# Altium project PowerSystem.PrjPCB
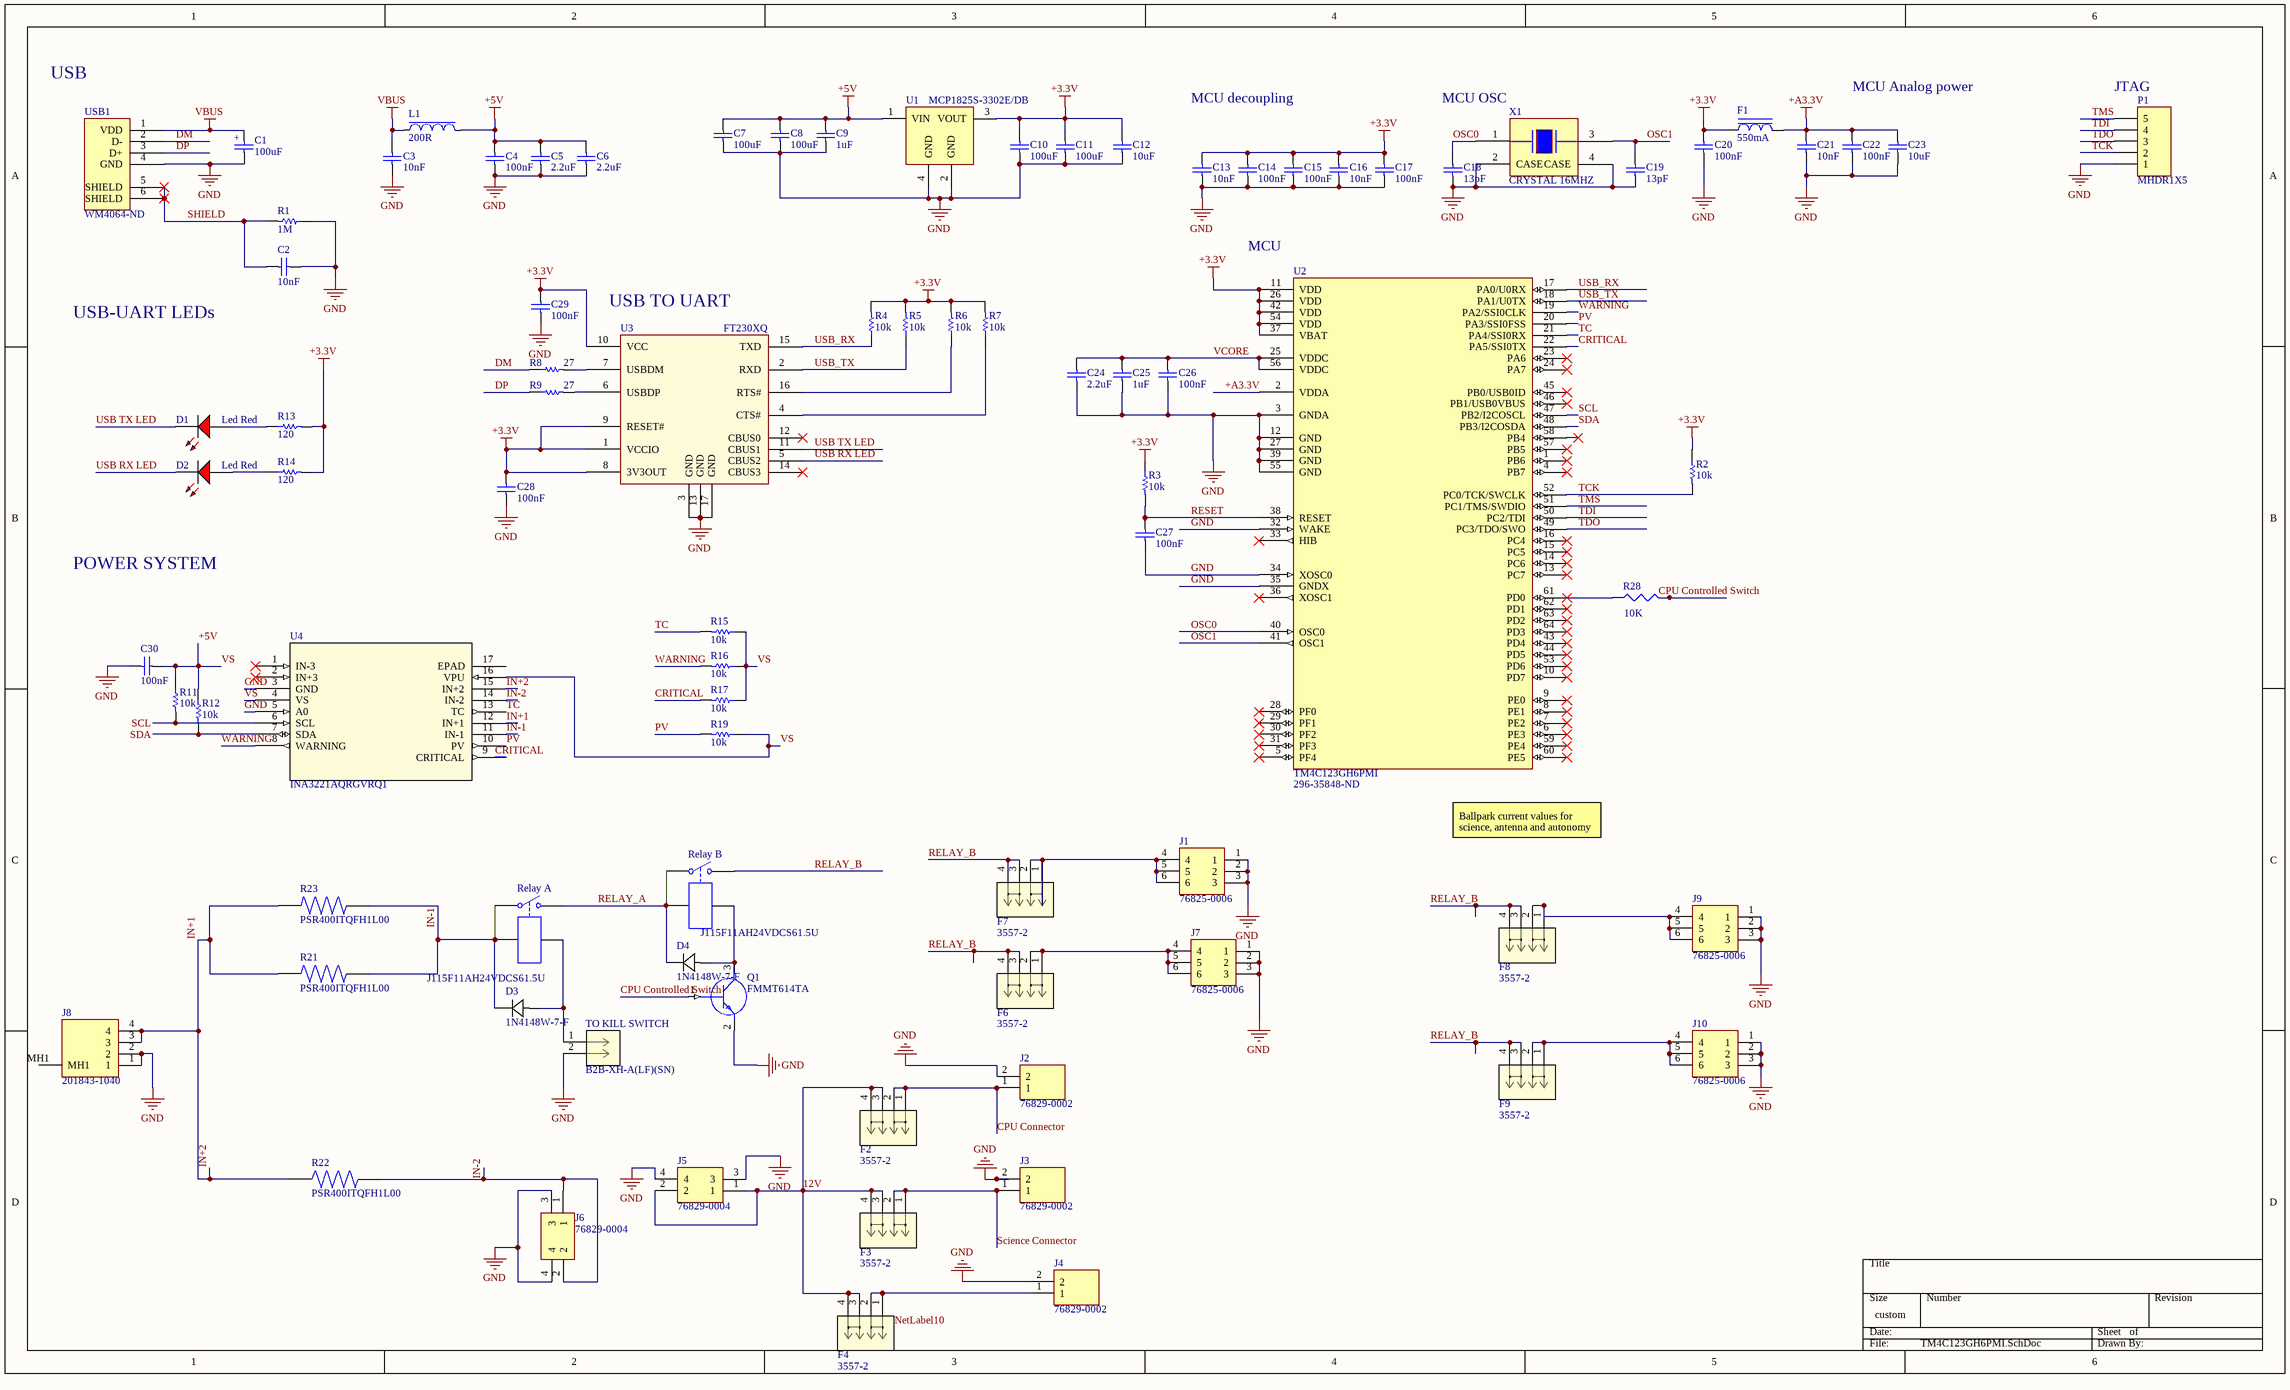
[diagram p0: TM4C123GH6PMI.SchDoc]
1 sheet, 85 parts. Net scope: global (net labels, ports and power ports of the same name join across sheets).
Board file: PCB_power.PcbDoc

## Sheet TM4C123GH6PMI.SchDoc
size 508 x 304 mm

### Parts
C1  100uF  [CapAlu6.3mmx12.5mm]
C2  10nF  [CAP_1206]
C3  10nF  [CAP_0402_M]
C4  100nF  [CAP_0402_M]
C5  2.2uF  [CAP_0402_M]
C6  2.2uF  [CAP_0402_M]
C7  100uF  [CAP_1206]
C8  100uF  [CAP_1206]
C9  1uF  [CAP_0402_M]
C10  100uF  [CAP_1206]
C11  100uF  [CAP_1206]
C12  10uF  [CAP_0603]
C13  10nF  [CAP_0402_M]
C14  100nF  [CAP_0402_M]
C15  100nF  [CAP_0402_M]
C16  10nF  [CAP_0402_M]
C17  100nF  [CAP_0402_M]
C18  13pF  [CAP_0402_M]
C19  13pF  [CAP_0402_M]
C20  100nF  [CAP_0402_M]
C21  10nF  [CAP_0402_M]
C22  100nF  [CAP_0402_M]
C23  10uF  [CAP_0603]
C24  2.2uF  [CAP_0603]
C25  1uF  [CAP_0402_M]
C26  100nF  [CAP_0402_M]
C27  100nF  [CAP_0402_M]
C28  100nF  [CAP_0402_M]
C29  100nF  [CAP_0402_M]
C30  100nF  [CAP_0603]
D1  Led Red  [TOPLED 0805]
D2  Led Red  [TOPLED 0805]
D3  1N4148W-7-F  [SOD123_DIO]
D4  1N4148W-7-F  [SOD123_DIO]
F1  550mA  [RES_0402_M]
F2  3557-2  [CONN_3557-2_KEY]
F3  3557-2  [CONN_3557-2_KEY]
F4  3557-2  [CONN_3557-2_KEY]
F6  3557-2  [CONN_3557-2_KEY]
F7  3557-2  [CONN_3557-2_KEY]
F8  3557-2  [CONN_3557-2_KEY]
F9  3557-2  [CONN_3557-2_KEY]
J1  76825-0006  [0768250006]
J2  76829-0002  [768290002]
J3  76829-0002  [768290002]
J4  76829-0002  [768290002]
J5  76829-0004  [768290004]
J6  76829-0004  [768290004]
J7  76825-0006  [0768250006]
J8  201843-1040  [2018431040]
J9  76825-0006  [0768250006]
J10  76825-0006  [0768250006]
L1  200R  [IND_0603]
P1  MHDR1X5  [MHDR1X5]
Q1  FMMT614TA  [SOT95P230X110-3N]
R1  1M  [RES_1206]
R2  10k  [RES_0402_M]
R3  10k  [RES_0402_M]
R4  10k  [RES_0402_M]
R5  10k  [RES_0402_M]
R6  10k  [RES_0402_M]
R7  10k  [RES_0402_M]
R8  27  [RES_0402_M]
R9  27  [RES_0402_M]
R11  10k  [RES_0603]
R12  10k  [RES_0603]
R13  120  [RES_0402_M]
R14  120  [RES_0402_M]
R15  10k  [RES_0603]
R16  10k  [RES_0603]
R17  10k  [RES_0603]
R19  10k  [RES_0603]
R21  PSR400ITQFH1L00  [RESC10052X105N]
R22  PSR400ITQFH1L00  [RESC10052X105N]
R23  PSR400ITQFH1L00  [RESC10052X105N]
R28  value 10K  [J1-0603]
Relay_A  J115F11AH24VDCS61.5U  [MODULE4]
Relay_B  J115F11AH24VDCS61.5U  [MODULE4]
TO_KILL_SWITCH  B2B-XH-A(LF)(SN)  [CONN_B2B-XH-A(LF)(SN)_JST]
U1  MCP1825S-3302E/DB  [SOT230P700X180-4N]
U2  TM4C123GH6PMI  Supplier Part Number 1: 296-35848-ND  [TSQFP50P1200X1200X120-64N]
U3  FT230XQ  [QFN65P400X400X80_HS-17N]
U4  INA3221AQRGVRQ1  [RGV16_2P16X2P16_]
USB1  Supplier Part Number 1: WM4064-ND  [USB2.5-2H4E]  (hidden comment: USB type-B jack)
X1  CRYSTAL 16MHZ  [CRYSTAL_3.2x2.5]

### Nets
+3.3V: C10.1 C11.1 C12.1 C13.2 C14.2 C15.2 C16.2 C17.2 C20.2 C28.2 C29.2 F1.1 R2.1 R3.1 R4.2 R5.2 R6.2 R7.2 R13.2 R14.2 U1.3(VOUT) U2.11(VDD) U2.26(VDD) U2.37(VBAT) U2.42(VDD) U2.54(VDD) U3.1(VCCIO) U3.8(3V3OUT) U3.9(RESET#) U3.10(VCC)
+5V: C4.2 C5.2 C6.2 C7.1 C8.1 C9.2 C30.2 L1.2 R11.1 R12.1 R15.1 R16.1 R17.1 R19.1 U1.1(VIN) U4.4(VS) U4.16(VPU)  [also labelled VS]
+A3.3V: C21.2 C22.2 C23.2 F1.2 U2.2(VDDA)
GND: C1.2 C2.1 C3.1 C4.1 C5.1 C6.1 C7.2 C8.2 C9.1 C10.2 C11.2 C12.2 C13.1 C14.1 C15.1 C16.1 C17.1 C18.1 C19.1 C20.1 C21.1 C22.1 C23.1 C24.1 C25.1 C26.1 C27.1 C28.1 C29.1 C30.1 J1.1 J1.2 J1.3 J2.2 J3.2 J4.2 J5.3 J5.4 J6.3 J6.4 J7.1 J7.2 J7.3 J8.1 J8.2 J9.1 J9.2 J9.3 J10.1 J10.2 J10.3 P1.1 Q1.2(E) R1.1 TO_KILL_SWITCH.2 U1.2(GND) U1.4(GND) U2.3(GNDA) U2.12(GND) U2.27(GND) U2.32(WAKE) U2.34(XOSC0) U2.35(GNDX) U2.39(GND) U2.55(GND) U3.3(GND) U3.13(GND) U3.17(GND) U4.3(GND) U4.5(A0) USB1.4(GND) X1.2(CASE) X1.4(CASE)
VBUS: C1.1 C3.2 L1.1 USB1.1(VDD)
12V: F2.3 F2.4 F3.3 F3.4 F4.3 F4.4 J5.1 J5.2
CPU Connector: F2.1 F2.2 J2.1
CPU Controlled Switch: Q1.1(B) R28.2
CRITICAL: R17.2 U2.22(PA5/SSI0TX) U4.9(CRITICAL)
DM: R8.1 USB1.2(D-)
DP: R9.1 USB1.3(D+)
IN+1: J8.3 J8.4 R21.1 R22.1 R23.1 U4.12(IN+1) U4.15(IN+2)  [also labelled IN+2]
IN-1: D3.1 R21.2 R23.2 Relay_A.1 Relay_A.3 U4.11(IN-1)
IN-2: J6.1 J6.2 R22.2 U4.14(IN-2)
OSC0: C18.2 U2.40(OSC0) X1.1
OSC1: C19.2 U2.41(OSC1) X1.3
PV: R19.2 U2.20(PA3/SSI0FSS) U4.10(PV)
RELAY_A: D4.1 Relay_A.2 Relay_B.1 Relay_B.3
RELAY_B: F6.3 F6.4 F7.3 F7.4 F8.3 F8.4 F9.3 F9.4 Relay_B.2
RESET: C27.2 R3.2 U2.38(RESET)
Science Connector: F3.1 F3.2 J3.1
SCL: R11.2 U2.47(PB2/I2COSCL) U4.6(SCL)
SDA: R12.2 U2.48(PB3/I2COSDA) U4.7(SDA)
SHIELD: C2.2 R1.2 USB1.5(SHIELD) USB1.6(SHIELD)
TC: R15.2 U2.21(PA4/SSI0RX) U4.13(TC)
TCK: P1.2 R2.2 U2.52(PC0/TCK/SWCLK)
TDI: P1.4 U2.50(PC2/TDI)
TDO: P1.3 U2.49(PC3/TDO/SWO)
TMS: P1.5 U2.51(PC1/TMS/SWDIO)
USB RX LED: D2.2(K) U3.5(CBUS2)
USB TX LED: D1.2(K) U3.11(CBUS1)
USB_RX: R4.1 U2.17(PA0/U0RX) U3.15(TXD)
USB_TX: R5.1 U2.18(PA1/U0TX) U3.2(RXD)
VCORE: C24.2 C25.2 C26.2 U2.25(VDDC) U2.56(VDDC)
WARNING: R16.2 U2.19(PA2/SSI0CLK) U4.8(WARNING)
NetD1_1: D1.1(A) R13.1
NetD2_1: D2.1(A) R14.1
NetD3_2: D3.2 Relay_A.4 TO_KILL_SWITCH.1
NetD4_2: D4.2 Q1.3(C) Relay_B.4
NetF4_1: F4.1 F4.2 J4.1
NetF6_1: F6.1 F6.2 J7.4 J7.5 J7.6
NetF7_1: F7.1 F7.2 J1.4 J1.5 J1.6
NetF8_1: F8.1 F8.2 J9.4 J9.5 J9.6
NetF9_1: F9.1 F9.2 J10.4 J10.5 J10.6
NetR6_1: R6.1 U3.16(RTS#)
NetR7_1: R7.1 U3.4(CTS#)
NetR8_2: R8.2 U3.7(USBDM)
NetR9_2: R9.2 U3.6(USBDP)
NetR28_1: R28.1 U2.61(PD0)

Not connected (* = marked no-connect by the designer): J8 MH1; U2 1(PB6)* 4(PB7)* 5(PF4)* 6(PE3)* 7(PE2)* 8(PE1)* 9(PE0)* 10(PD7)* 13(PC7)* 14(PC6)* 15(PC5)* 16(PC4)* 23(PA6)* 24(PA7)* 28(PF0)* 29(PF1)* 30(PF2)* 31(PF3)* 33(HIB)* 36(XOSC1)* 43(PD4)* 44(PD5)* 45(PB0/USB0ID)* 46(PB1/USB0VBUS)* 53(PD6)* 57(PB5)* 58(PB4)* 59(PE4)* 60(PE5)* 62(PD1)* 63(PD2)* 64(PD3)*; U3 12(CBUS0)* 14(CBUS3)*; U4 1(IN-3)* 2(IN+3)* 17(EPAD)

### Notes on the sheet
- USB
- MCU decoupling
- MCU OSC
- MCU Analog power
- (near P1) JTAG
- MCU
- (near U3) USB TO UART
- USB-UART LEDs
- POWER SYSTEM
- Ballpark current values for science, antenna and autonomy
- Labels drawn without touching a wire or pin: NetLabel10
- (in symbol 100uF_35v_6.3x12.5) +

### Library data of the parts
C1 = 100uF_35v_6.3x12.5: Capacitor 35v 100uF 6.3mm; Manufacturer: Nichicon; Manufacturer Part Number: UHV1V101MED; Capacitance: 100µF; Tolerance: ±20%; Lifetime @ Temp.: 5000 Hrs @ 105°C; Polarization: Polar; Ripple Current: 220mA @ 120Hz; Impedance: 100 mOhm; Supplier 1: Digi-Key; RoHS: RoHS Compliant; Category: Capacitors; Stock 1: 5561; Pricing 1: 1=0.46, 10=0.32, 25=0.262, 50=0.224, 100=0.1919, 250=0.15992, 500=0.14394, 1000=0.12155, 2500=0.11515 (CAD); Packaging: Bulk; Voltage Rating: 35V; ESR (Equivalent Series Resistance): -; Operating Temperature: -40°C ~ 105°C; Applications: General Purpose; Lead Spacing: 0.098" (2.50mm); Size / Dimension: 0.248" Dia (6.30mm); Height - Seated (Max): 0.492" (12.50mm); Surface Mount Land Size: -; Mounting Type: Through Hole; Package / Case: Radial, Can; ComponentLink1URL: http://nichicon-us.com/english/products/pdfs/e-uhv.pdf; ComponentLink1Description: http://nichicon-us.com/english/products/pdfs/e-uhv.pdf; Supplier Part Number 1: 493-13394-ND
C2 = 10nF_500V_1206: CAP CER 10000PF 500V X7R 1206; Manufacturer: Samsung Electro-Mechanics America, Inc; Manufacturer Part Number: CL31B103KGFNNNE; Tolerance: ±10%; Supplier 1: Digi-Key; Supplier Part Number 1: 1276-3076-1-ND; RoHS: RoHS Compliant; Category: Capacitors; Stock 1: 9075; Pricing 1: 1=0.34, 10=0.28, 25=0.192, 100=0.1398, 500=0.09266, 1000=0.08216 (CAD); Packaging: Cut Tape (CT); Capacitance: 10000pF; Voltage - Rated: 500V; Temperature Coefficient: X7R; Mounting Type: Surface Mount, MLCC; Operating Temperature: -55°C ~ 125°C; Applications: General Purpose; Ratings: -; Package / Case: 1206 (3216 Metric); Size / Dimension: 0.126" L x 0.063" W (3.20mm x 1.60mm); Height - Seated (Max): -; Thickness (Max): 0.055" (1.40mm); Lead Spacing: -; Features: -; Lead Style: -; ComponentLink1URL: http://www.samsungsem.com/kr/front/downloadcms.do?path=/kr/support/product-search/mlcc/__icsFiles/afieldfile/2014/11/05&fileName=S_CL31B103KGFNNNE.pdf; ComponentLink1Description: http://www.samsungsem.com/kr/front/downloadcms.do?path=/kr/support/product-search/mlcc/__icsFiles/afieldfile/2014/11/05&fileName=S_CL31B103KGFNNNE.pdf
C3 C13 C16 C21 = 10nF_50V_0402: CAP CER 10000PF 50V 10% X7R 0402; Manufacturer: Kemet; Manufacturer Part Number: C0402C103K5RACTU; Supplier 1: Digi-Key; RoHS: RoHS Compliant; Category: Capacitors; Stock 1: 3556921; Pricing 1: 1=0.14, 10=0.037, 25=0.026, 50=0.0198, 100=0.0166, 250=0.01364, 1000=0.00893, 2500=0.00804, 5000=0.00744 (CAD); Packaging: Cut Tape (CT); Capacitance: 10000pF; Tolerance: ±10%; Voltage - Rated: 50V; Temperature Coefficient: X7R; Mounting Type: Surface Mount, MLCC; Operating Temperature: -55°C ~ 125°C; Applications: General Purpose; Ratings: -; Package / Case: 0402 (1005 Metric); Size / Dimension: 0.039" L x 0.020" W (1.00mm x 0.50mm); Height - Seated (Max): -; Thickness (Max): 0.022" (0.55mm); Lead Spacing: -; Features: -; Lead Style: -; ComponentLink1URL: http://www.kemet.com/docfinder?Partnumber=C0402C103K5RACTU; ComponentLink1Description: http://www.kemet.com/docfinder?Partnumber=C0402C103K5RACTU; Supplier Part Number 1: 399-3066-1-ND
C4 C14 C15 C17 C20 C22 C26-C29 = 100nF_50V_0402: CAP CER 100NF 50V 20% X5R 0402; Manufacturer: TDK Corporation; Manufacturer Part Number: C1005X5R1H104M050BB; Capacitance: 0.1µF; Supplier 1: Digi-Key; RoHS: RoHS Compliant; Category: Capacitors; Stock 1: 218263; Pricing 1: 1=0.18, 10=0.122, 100=0.0579, 250=0.04872, 500=0.0408, 1000=0.03348, 5000=0.02831 (CAD); Packaging: Cut Tape (CT); Tolerance: ±20%; Voltage - Rated: 50V; Temperature Coefficient: X5R; Mounting Type: Surface Mount, MLCC; Operating Temperature: -55°C ~ 85°C; Applications: General Purpose; Ratings: -; Package / Case: 0402 (1005 Metric); Size / Dimension: 0.039" L x 0.020" W (1.00mm x 0.50mm); Height - Seated (Max): -; Thickness (Max): 0.022" (0.55mm); Lead Spacing: -; Features: -; Lead Style: -; ComponentLink1URL: http://product.tdk.com/en/catalog/datasheets/mlcc_commercial_general_en.pdf; ComponentLink1Description: http://product.tdk.com/en/catalog/datasheets/mlcc_commercial_general_en.pdf; Supplier Part Number 1: 445-5943-1-ND
C5 C6 = 2.2uF_10V_0402: CAP CER 2.2UF 10V 20% X5R 0402; Manufacturer: Taiyo Yuden; Manufacturer Part Number: LMK105BJ225MV-F; Capacitance: 2.2µF; Supplier 1: Digi-Key; RoHS: RoHS Compliant; Category: Capacitors; Stock 1: 258065; Pricing 1: 1=0.26, 10=0.173, 50=0.105, 100=0.0881, 250=0.07132, 500=0.0629, 1000=0.05348, 2500=0.04928, 5000=0.04509 (CAD); Packaging: Cut Tape (CT); Tolerance: ±20%; Voltage - Rated: 10V; Temperature Coefficient: X5R; Mounting Type: Surface Mount, MLCC; Operating Temperature: -55°C ~ 85°C; Applications: General Purpose; Ratings: -; Package / Case: 0402 (1005 Metric); Size / Dimension: 0.039" L x 0.020" W (1.00mm x 0.50mm); Height - Seated (Max): -; Thickness (Max): 0.022" (0.55mm); Lead Spacing: -; Features: -; Lead Style: -; ComponentLink1URL: http://www.yuden.co.jp/ut/product/category/capacitor/LMK105BJ225MV-F.pdf; ComponentLink1Description: http://www.yuden.co.jp/ut/product/category/capacitor/LMK105BJ225MV-F.pdf; Supplier Part Number 1: 587-3153-1-ND
C7 C8 C10 C11 = 100uF_6.3v_1206_X5R: CAP CER 100UF 6.3V X5R 1206; Manufacturer: Murata Electronics North America; Manufacturer Part Number: GRM31CR60J107ME39L; Capacitance: 100µF; Tolerance: ±20%; Supplier 1: Digi-Key; RoHS: RoHS Compliant; Category: Capacitors; Stock 1: 450179; Pricing 1: 1=1.23, 10=1.048, 50=0.771, 100=0.6128, 250=0.51396, 500=0.46456, 1000=0.42502 (CAD); Packaging: Cut Tape (CT); Voltage - Rated: 6.3V; Temperature Coefficient: X5R; Mounting Type: Surface Mount, MLCC; Operating Temperature: -55°C ~ 85°C; Applications: General Purpose; Ratings: -; Package / Case: 1206 (3216 Metric); Size / Dimension: 0.126" L x 0.063" W (3.20mm x 1.60mm); Height - Seated (Max): -; Thickness (Max): 0.071" (1.80mm); Lead Spacing: -; Features: -; Lead Style: -; ComponentLink1URL: http://www.murata.com/~/media/webrenewal/support/library/catalog/products/capacitor/mlcc/c02e.pdf; ComponentLink1Description: http://www.murata.com/~/media/webrenewal/support/library/catalog/products/capacitor/mlcc/c02e.pdf; Supplier Part Number 1: 490-4539-1-ND
C9 C25 = 1uF_25V_0402: CAP CER 1UF 25V 10% X5R 0402; Manufacturer: TDK Corporation; Manufacturer Part Number: C1005X5R1E105K050BC; Capacitance: 1µF; Supplier 1: Digi-Key; RoHS: RoHS Compliant; Category: Capacitors; Stock 1: 310467; Pricing 1: 1=0.27, 10=0.185, 100=0.0878, 250=0.074, 500=0.06196, 1000=0.05087, 5000=0.04301 (CAD); Packaging: Cut Tape (CT); Tolerance: ±10%; Voltage - Rated: 25V; Temperature Coefficient: X5R; Mounting Type: Surface Mount, MLCC; Operating Temperature: -55°C ~ 85°C; Applications: General Purpose; Ratings: -; Package / Case: 0402 (1005 Metric); Size / Dimension: 0.039" L x 0.020" W (1.00mm x 0.50mm); Height - Seated (Max): -; Thickness (Max): 0.022" (0.55mm); Lead Spacing: -; Features: -; Lead Style: -; ComponentLink1URL: http://product.tdk.com/en/catalog/datasheets/mlcc_commercial_general_en.pdf; ComponentLink1Description: http://product.tdk.com/en/catalog/datasheets/mlcc_commercial_general_en.pdf; Supplier Part Number 1: 445-9066-1-ND
C12 C23 = 10uF_10V_0603: CAP CER 10UF 10V 20% X5R 0603; Manufacturer: Taiyo Yuden; Manufacturer Part Number: LMK107BBJ106MAHT; Capacitance: 10µF; Supplier 1: Digi-Key; Supplier Part Number 1: 587-3412-1-ND; RoHS: RoHS Compliant; Category: Capacitors; Stock 1: 90195; Pricing 1: 1=0.5, 10=0.437, 50=0.266, 100=0.2189, 250=0.17516, 500=0.15952, 1000=0.14107 (CAD); Packaging: Cut Tape (CT); Tolerance: ±20%; Voltage - Rated: 10V; Temperature Coefficient: X5R; Mounting Type: Surface Mount, MLCC; Operating Temperature: -55°C ~ 85°C; Applications: Automotive; Ratings: AEC-Q200; Package / Case: 0603 (1608 Metric); Size / Dimension: 0.063" L x 0.031" W (1.60mm x 0.80mm); Height - Seated (Max): -; Thickness (Max): 0.035" (0.90mm); Lead Spacing: -; Features: -; Lead Style: -; ComponentLink1URL: http://www.yuden.co.jp/productdata/catalog/en/mlcc01_hq_e.pdf; ComponentLink1Description: http://www.yuden.co.jp/productdata/catalog/en/mlcc01_hq_e.pdf
C18 C19 = 13pF_50V_0402: CAP CER 13PF 50V 5% NP0 0402; Manufacturer: Samsung Electro-Mechanics America, Inc; Manufacturer Part Number: CL05C130JB5NNNC; Temperature Coefficient: C0G, NP0; Supplier 1: Digi-Key; RoHS: RoHS Compliant; Category: Capacitors; Stock 1: 16490; Pricing 1: 1=0.14, 10=0.064, 25=0.0448, 100=0.0291, 500=0.02032, 1000=0.01583, 2500=0.01425, 5000=0.01319 (CAD); Packaging: Cut Tape (CT); Capacitance: 13pF; Tolerance: ±5%; Voltage - Rated: 50V; Mounting Type: Surface Mount, MLCC; Operating Temperature: -55°C ~ 125°C; Applications: General Purpose; Ratings: -; Package / Case: 0402 (1005 Metric); Size / Dimension: 0.039" L x 0.020" W (1.00mm x 0.50mm); Height - Seated (Max): -; Thickness (Max): 0.022" (0.55mm); Lead Spacing: -; Features: -; Lead Style: -; ComponentLink1URL: http://www.samsungsem.com/kr/front/downloadcms.do?path=/kr/support/product-search/mlcc/__icsFiles/afieldfile/2014/11/05&fileName=S_CL05C130JB5NNNC.pdf; ComponentLink1Description: http://www.samsungsem.com/kr/front/downloadcms.do?path=/kr/support/product-search/mlcc/__icsFiles/afieldfile/2014/11/05&fileName=S_CL05C130JB5NNNC.pdf; Supplier Part Number 1: 1276-1642-1-ND
C24 = 2.2uF_35V_0603: CAP CER 2.2UF 35V 10% X5R 0603; Manufacturer: Murata Electronics North America; Manufacturer Part Number: GRM188R6YA225KA12D; Capacitance: 2.2µF; Supplier 1: Digi-Key; Supplier Part Number 1: 490-7204-1-ND; RoHS: RoHS Compliant; Category: Capacitors; Stock 1: 55248; Pricing 1: 1=0.31, 10=0.214, 50=0.1298, 100=0.109, 250=0.08832, 500=0.07792, 1000=0.06624 (CAD); Packaging: Cut Tape (CT); Tolerance: ±10%; Voltage - Rated: 35V; Temperature Coefficient: X5R; Mounting Type: Surface Mount, MLCC; Operating Temperature: -55°C ~ 85°C; Applications: General Purpose; Ratings: -; Package / Case: 0603 (1608 Metric); Size / Dimension: 0.063" L x 0.031" W (1.60mm x 0.80mm); Height - Seated (Max): -; Thickness (Max): 0.031" (0.80mm); Lead Spacing: -; Features: -; Lead Style: -; ComponentLink1URL: http://www.murata.com/~/media/webrenewal/support/library/catalog/products/capacitor/mlcc/c02e.ashx; ComponentLink1Description: http://www.murata.com/~/media/webrenewal/support/library/catalog/products/capacitor/mlcc/c02e.ashx
C30 = 100nF_50V_0603: CAP CER 0.1UF 50V 20% X7R 0603; Manufacturer: Kemet; Manufacturer Part Number: C0603C104M5RACTU; Capacitance: 0.1µF; Supplier 1: Digi-Key; RoHS: RoHS Compliant; Category: Capacitors; Stock 1: 171007; Pricing 1: 1=0.13, 10=0.034, 25=0.024, 50=0.0184, 100=0.0155, 250=0.01268, 1000=0.0083 (CAD); Packaging: Cut Tape (CT); Tolerance: ±20%; Voltage - Rated: 50V; Temperature Coefficient: X7R; Mounting Type: Surface Mount, MLCC; Operating Temperature: -55°C ~ 125°C; Applications: General Purpose; Ratings: -; Package / Case: 0603 (1608 Metric); Size / Dimension: 0.063" L x 0.031" W (1.60mm x 0.80mm); Height - Seated (Max): -; Thickness (Max): 0.034" (0.87mm); Lead Spacing: -; Features: -; Lead Style: -; ComponentLink1URL: http://www.kemet.com/docfinder?Partnumber=C0603C104M5RACTU; ComponentLink1Description: http://www.kemet.com/docfinder?Partnumber=C0603C104M5RACTU; Supplier Part Number 1: 399-7845-1-ND
D1 D2 = TOPLED 0803: LED TOPLED 630NM SUP RED CLR SMD; Manufacturer: OSRAM Opto Semiconductors Inc; Manufacturer Part Number: LS M67K-H2L1-1-Z; Wavelength - Peak: 643nm; Millicandela Rating: 8.78mcd; Voltage - Forward (Vf) (Typ): 1.8V; Current - Test: 2mA; Viewing Angle: 120°; Lens Type: Clear; Lens Style/Size: Rectangle with Flat Top, 1.5mm x 1mm; Luminous Flux @ Current - Test: 25 mlm; Supplier 1: Digi-Key; Supplier Part Number 1: 475-2510-1-ND; RoHS: RoHS Compliant; Category: Optoelectronics; Stock 1: 23262; Pricing 1: 1=0.19, 10=0.162, 100=0.1295, 250=0.11328, 500=0.10354 (CAD); Packaging: Cut Tape (CT); Color: Red; Wavelength - Dominant: 630nm; Package / Case: 2-SMD, J-Lead; Size / Dimension: 2.20mm L x 1.40mm W; Height: 1.30mm; Mounting Type: Surface Mount; ComponentLink1URL: http://media.digikey.com/pdf/Data%20Sheets/Osram%20PDFs/LS,LO,LY_M67K.pdf; ComponentLink1Description: http://media.digikey.com/pdf/Data%20Sheets/Osram%20PDFs/LS,LO,LY_M67K.pdf
D3 D4 = 1N4148W-7-F: No Description Available; Vendor: Diodes Inc; Built_By: EMA_Anthony; SourceLibrary: Diodes_Inc_2018-12-15; Type: DEV; Manufacturer_Part_Number: 1N4148W-7-F; Copyright: Copyright (C) 2016 Accelerated Designs. All rights reserved; RefDes: RefDes
F1 = 40O_550mA_0402: FERRITE CHIP 40 OHM 550MA 0402; Manufacturer: TDK Corporation; Manufacturer Part Number: MMZ1005Y400CT000; Impedance @ Frequency: 40 Ohm @ 100MHz; DC Resistance (DCR): 120 mOhm Max; Filter Type: Differential Mode - Single; Supplier 1: Digi-Key; RoHS: RoHS Compliant; Category: Filters; Stock 1: 1706; Pricing 1: 1=0.14, 10=0.099, 100=0.059, 250=0.04284, 500=0.03928, 1000=0.03393, 5000=0.02679 (CAD); Packaging: Cut Tape (CT); Current Rating: 550mA; Package / Case: 0402 (1005 Metric); Mounting Type: Surface Mount; Height (Max): 0.022" (0.55mm); Size / Dimension: 0.039" L x 0.020" W (1.00mm x 0.50mm); ComponentLink1URL: http://product.tdk.com/emc/beads/en/documents/beads_commercial_signal_mmz_en.pdf; ComponentLink1Description: http://product.tdk.com/emc/beads/en/documents/beads_commercial_signal_mmz_en.pdf; Supplier Part Number 1: 445-2150-1-ND
F2-F4 F6-F9 = 3557-2: No Description Available; Vendor: Keystone Electronics; Built_By: EMA_Cory; SourceLibrary: Keystone Electronics_Complete_2020-01-22; Type: DEV; Manufacturer_Part_Number: 3557-2; Copyright: Copyright (C) 2018 Accelerated Designs. All rights reserved; RefDes: RefDes
J1 J7 J9 J10 = 76825-0006: Connector; Manufacturer_Name: Molex; Datasheet Link: http://www.molex.com/webdocs/datasheets/pdf/en-us/0768250006_PCB_HEADERS.pdf; Height: 16mm; Manufacturer_Part_Number: 76825-0006; Mouser Part Number: 538-76825-0006; Mouser Price/Stock: https://www.mouser.co.uk/ProductDetail/Molex/76825-0006?qs=KpdAywxU0127%252BKA4qQrPHA%3D%3D
J2 = 76829-0002: CPU; Manufacturer_Name: Molex; Datasheet Link: https://www.molex.com/pdm_docs/sd/768290002_sd.pdf; Height: 14.8mm; Manufacturer_Part_Number: 76829-0002
J3 J4 = 76829-0002: Connector; Manufacturer_Name: Molex; Datasheet Link: https://www.molex.com/pdm_docs/sd/768290002_sd.pdf; Height: 14.8mm; Manufacturer_Part_Number: 76829-0002
J5 J6 = 76829-0004: Connector; Manufacturer_Name: Molex; Datasheet Link: https://www.molex.com/pdm_docs/sd/768290004_sd.pdf; Height: 14.8mm; Manufacturer_Part_Number: 76829-0004
J8 = 201843-1040: Connector; Manufacturer_Name: Molex; Datasheet Link: https://www.molex.com/pdm_docs/sd/2018431040_sd.pdf; Height: 11.58mm; Manufacturer_Part_Number: 201843-1040
L1 = Ferrite_200 ohms_2A: FILTER CHIP 220 OHM 2A 0603; Manufacturer: Murata Electronics North America; Manufacturer Part Number: BLM18EG221SN1D; Impedance @ Frequency: 220 Ohm @ 100MHz; DC Resistance (DCR): 50 mOhm Max; Filter Type: Differential Mode - Single; Supplier 1: Digi-Key; RoHS: RoHS Compliant; Category: Filters; Stock 1: 382631; Pricing 1: 1=0.33, 10=0.254, 50=0.1814, 100=0.1632, 250=0.13784, 500=0.12332, 1000=0.10519 (CAD); Packaging: Cut Tape (CT); Current Rating: 2A; Package / Case: 0603 (1608 Metric); Mounting Type: Surface Mount; Height (Max): 0.037" (0.95mm); Size / Dimension: 0.063" L x 0.031" W (1.60mm x 0.80mm); ComponentLink1URL: http://search.murata.co.jp/Ceramy/image/img/PDF/ENG/L0110S0101BLM18E.pdf; ComponentLink1Description: http://search.murata.co.jp/Ceramy/image/img/PDF/ENG/L0110S0101BLM18E.pdf; Supplier Part Number 1: 490-3992-1-ND
P1 = MHDR1X5: Header, 5-Pin; LatestRevisionDate: 17-Jul-2002; LatestRevisionNote: Re-released for DXP Platform.; Publisher: Altium Limited
Q1 = FMMT614TA: Transistor BJT NPN; Manufacturer_Name: Diodes Inc.; Datasheet Link: https://componentsearchengine.com/Datasheets/1/FMMT614TA.pdf; Height: 1.1mm; Manufacturer_Part_Number: FMMT614TA; Mouser Part Number: 522-FMMT614TA; Mouser Price/Stock: https://www.mouser.co.uk/ProductDetail/Diodes-Incorporated/FMMT614TA?qs=zhx2xqPtQQyFAr3i65ZddQ%3D%3D; Arrow Part Number: FMMT614TA; Arrow Price/Stock: https://www.arrow.com/en/products/fmmt614ta/diodes-incorporated
R1 = 1M_5%_1206: RES SMD 1M OHM 5% 1/4W 1206; Manufacturer: Panasonic Electronic Components; Manufacturer Part Number: ERJ-8GEYJ105V; Power (Watts): 0.25W, 1/4W; Temperature Coefficient: ±200ppm/°C; Supplier 1: Digi-Key; Supplier Part Number 1: P1.0MECT-ND; RoHS: RoHS Compliant; Category: Resistors; Stock 1: 165352; Pricing 1: 1=0.14, 50=0.038, 100=0.029, 250=0.02152, 500=0.01588, 1000=0.01059, 2500=0.00894 (CAD); Packaging: Cut Tape (CT); Resistance (Ohms): 1M; Tolerance: ±5%; Composition: Thick Film; Features: Automotive AEC-Q200; Operating Temperature: -55°C ~ 155°C; Package / Case: 1206 (3216 Metric); Supplier Device Package: 1206; Size / Dimension: 0.126" L x 0.063" W (3.20mm x 1.60mm); Height: 0.028" (0.70mm); Number of Terminations: 2; ComponentLink1URL: http://industrial.panasonic.com/www-cgi/jvcr13pz.cgi?E+PZ+3+AOA0001+ERJ8GEYJ105V+7+WW; ComponentLink1Description: http://industrial.panasonic.com/www-cgi/jvcr13pz.cgi?E+PZ+3+AOA0001+ERJ8GEYJ105V+7+WW
R2-R7 = 10k_1%_0402: RES SMD 10K OHM 1% 1/10W 0402; Manufacturer: Panasonic Electronic Components; Manufacturer Part Number: ERJ-2RKF1002X; Power (Watts): 0.1W, 1/10W; Temperature Coefficient: ±100ppm/°C; Supplier 1: Digi-Key; RoHS: RoHS Compliant; Category: Resistors; Stock 1: 5818216; Pricing 1: 1=0.14, 50=0.0282, 100=0.0215, 250=0.01592, 500=0.01176, 1000=0.00784, 5000=0.00551 (CAD); Packaging: Cut Tape (CT); Resistance (Ohms): 10k; Tolerance: ±1%; Composition: Thick Film; Features: Automotive AEC-Q200; Operating Temperature: -55°C ~ 155°C; Package / Case: 0402 (1005 Metric); Supplier Device Package: 0402; Size / Dimension: 0.039" L x 0.020" W (1.00mm x 0.50mm); Height: 0.016" (0.40mm); Number of Terminations: 2; ComponentLink1URL: http://industrial.panasonic.com/www-cgi/jvcr13pz.cgi?E+PZ+3+AOA0002+ERJ2RKF1002X+7+WW; ComponentLink1Description: http://industrial.panasonic.com/www-cgi/jvcr13pz.cgi?E+PZ+3+AOA0002+ERJ2RKF1002X+7+WW; Supplier Part Number 1: P10.0KLCT-ND
R8 R9 = 27_1%_0402: RES SMD 27 OHM 1% 1/10W 0402; Manufacturer: Panasonic Electronic Components; Manufacturer Part Number: ERJ-2RKF27R0X; Power (Watts): 0.1W, 1/10W; Temperature Coefficient: ±100ppm/°C; Supplier 1: Digi-Key; Supplier Part Number 1: P27.0LCT-ND; RoHS: RoHS Compliant; Category: Resistors; Stock 1: 490131; Pricing 1: 1=0.16, 50=0.0234, 100=0.0171, 250=0.01308, 500=0.01048, 1000=0.00771, 5000=0.00553 (CAD); Packaging: Cut Tape (CT); Resistance (Ohms): 27; Tolerance: ±1%; Composition: Thick Film; Features: Automotive AEC-Q200; Operating Temperature: -55°C ~ 155°C; Package / Case: 0402 (1005 Metric); Supplier Device Package: 0402; Size / Dimension: 0.039" L x 0.020" W (1.00mm x 0.50mm); Height: 0.016" (0.40mm); Number of Terminations: 2; ComponentLink1URL: http://industrial.panasonic.com/www-cgi/jvcr13pz.cgi?E+PZ+3+AOA0002+ERJ2RKF27R0X+7+WW; ComponentLink1Description: http://industrial.panasonic.com/www-cgi/jvcr13pz.cgi?E+PZ+3+AOA0002+ERJ2RKF27R0X+7+WW
R11 R12 R15-R17 R19 = 10k_1%_0603: RES SMD 10K OHM 1% 1/10W 0603; Manufacturer: Panasonic Electronic Components; Manufacturer Part Number: ERJ-3EKF1002V; Power (Watts): 0.1W, 1/10W; Temperature Coefficient: ±100ppm/°C; Supplier 1: Digi-Key; RoHS: RoHS Compliant; Category: Resistors; Stock 1: 7554180; Pricing 1: 1=0.14, 50=0.0206, 100=0.0157, 250=0.01164, 500=0.0086, 1000=0.00574, 2500=0.00484 (CAD); Packaging: Cut Tape (CT); Resistance (Ohms): 10k; Tolerance: ±1%; Composition: Thick Film; Features: Automotive AEC-Q200; Operating Temperature: -55°C ~ 155°C; Package / Case: 0603 (1608 Metric); Supplier Device Package: 0603; Size / Dimension: 0.063" L x 0.031" W (1.60mm x 0.80mm); Height: 0.022" (0.55mm); Number of Terminations: 2; ComponentLink1URL: http://industrial.panasonic.com/www-cgi/jvcr13pz.cgi?E+PZ+3+AOA0002+ERJ3EKF1002V+7+WW; ComponentLink1Description: http://industrial.panasonic.com/www-cgi/jvcr13pz.cgi?E+PZ+3+AOA0002+ERJ3EKF1002V+7+WW; Supplier Part Number 1: P10.0KHCT-ND
R13 R14 = 120_1%_0402: RES SMD 120 OHM 1% 1/10W 0402; Manufacturer: Panasonic Electronic Components; Manufacturer Part Number: ERJ-2RKF1200X; Power (Watts): 0.1W, 1/10W; Temperature Coefficient: ±100ppm/°C; Supplier 1: Digi-Key; RoHS: RoHS Compliant; Category: Resistors; Stock 1: 184236; Pricing 1: 1=0.14, 50=0.0282, 100=0.0215, 250=0.01592, 500=0.01176, 1000=0.00784, 5000=0.00551 (CAD); Packaging: Cut Tape (CT); Resistance (Ohms): 120; Tolerance: ±1%; Composition: Thick Film; Features: Automotive AEC-Q200; Operating Temperature: -55°C ~ 155°C; Package / Case: 0402 (1005 Metric); Supplier Device Package: 0402; Size / Dimension: 0.039" L x 0.020" W (1.00mm x 0.50mm); Height: 0.016" (0.40mm); Number of Terminations: 2; ComponentLink1URL: http://industrial.panasonic.com/www-cgi/jvcr13pz.cgi?E+PZ+3+AOA0002+ERJ2RKF1200X+7+WW; ComponentLink1Description: http://industrial.panasonic.com/www-cgi/jvcr13pz.cgi?E+PZ+3+AOA0002+ERJ2RKF1200X+7+WW; Supplier Part Number 1: P120LCT-ND
R21-R23 = PSR400ITQFH1L00: Res Metal Film 3921 1mOhm 1% 4W Â±75ppm/Â°C Molded SMD Emboss T/R; Package: None; Price: None; Value: *; MP: PSR400ITQFH1L00; Availability: Unavailable
R28 = Res3: Resistor; Published: 8-Jun-2000; LatestRevisionDate: 29-May-2009; LatestRevisionNote: IPC-7351 Footprint Added.; PackageReference: J1-0603; Publisher: Altium Limited; PackageDescription: Chip Resistor
Relay_A Relay_B = Relay-SPST: Single-Pole Single-Throw Relay; Published: 24-Mar-1999; LatestRevisionDate: 17-Jul-2002; LatestRevisionNote: Re-released for DXP Platform.; PackageReference: MODULE4; Publisher: Altium Limited
TO_KILL_SWITCH = B2B-XH-A(LF)(SN): No Description Available; Vendor: JST; Built_By: EMA_Cory; SourceLibrary: JST_2019-12-02; Manufacturer_Part_Number: B2B-XH-A(LF)(SN); Copyright: Copyright (C) 2018 Accelerated Designs. All rights reserved; RefDes: RefDes; Type: DEV
U1 = MCP1825S-3302E/DB: 500 mA, Low Voltage, Low Quiescent Current LDO Regulator; Manufacturer: Microchip Technology; Regulator Topology: Positive Fixed; Voltage - Output: 3.3V; Current - Output: 500mA; Voltage - Dropout (Typical): 0.21V @ 500mA; Number of Regulators: 1; Voltage - Input: Up to 6V; Supplier 1: Digi-Key; Supplier Part Number 1: MCP1825S-3302E/DB-ND; Manufacturer Part Number: MCP1825S-3302E/DB; RoHS: RoHS Compliant; Category: Integrated Circuits (ICs); Stock 1: 5172; Pricing 1: 1=0.61, 10=0.51, 25=0.43, 100=0.39 (USD); Packaging: Tube; Current - Limit (Min): -; Operating Temperature: -40°C ~ 125°C; Mounting Type: Surface Mount; Package / Case: TO-261-4, TO-261AA; Supplier Device Package: SOT-223-3; ComponentLink1URL: http://www.microchip.com/mymicrochip/filehandler.aspx?ddocname=en531698; ComponentLink1Description: http://www.microchip.com/mymicrochip/filehandler.aspx?ddocname=en531698
U2 = TM4C123GH6PMI: Tiva TM4C123GH6PM Microcontroller ARM Cortex 80 MHz FPU; Supplier 1: Digi-Key
U3 = FT230XQ-R: IC USB SERIAL BASIC UART 16QFN; Manufacturer: FTDI, Future Technology Devices International Ltd; Function: Bridge, USB to UART; Standards: USB 2.0; Voltage - Supply: 3.3 V ~ 5 V; Current - Supply: 8mA; Supplier 1: Digi-Key; Supplier Part Number 1: 768-1130-1-ND; Manufacturer Part Number: FT230XQ-R; RoHS: RoHS Compliant; Category: Integrated Circuits (ICs); Stock 1: 7567; Pricing 1: 1=2.64, 25=2.5508, 100=2.4601, 250=2.21412, 500=1.994, 1000=1.89042, 2500=1.86128 (CAD); Packaging: Cut Tape (CT); Protocol: USB; Interface: UART; Operating Temperature: -40°C ~ 85°C; Package / Case: 16-WQFN Exposed Pad; Supplier Device Package: 16-QFN (4x4); ComponentLink1URL: http://www.ftdichip.com/Support/Documents/DataSheets/ICs/DS_FT230X.pdf; ComponentLink1Description: http://www.ftdichip.com/Support/Documents/DataSheets/ICs/DS_FT230X.pdf
U4 = INA3221AQRGVRQ1: No Description Available; Vendor: Texas Instruments; Built_By: EMA_Jessica; SourceLibrary: TI_2019-03-25_3; Manufacturer_Part_Number: INA3221AQRGVRQ1; Copyright: Copyright (C) 2018 Accelerated Designs. All rights reserved; RefDes: RefDes; Type: DEV
USB1 = MOLEX 0670688010: Supplier 1: Digi-Key
X1 = 403C35E16M00000: CRYSTAL 16MHZ 20PF SMD; Manufacturer: CTS-Frequency Controls; Frequency Stability: ±50ppm; Frequency Tolerance: ±30ppm; ESR (Equivalent Series Resistance): 80 Ohm; Operating Mode: Fundamental; Supplier 1: Digi-Key; Manufacturer Part Number: 403C35E16M00000; RoHS: RoHS Compliant; Category: Crystals and Oscillators; Stock 1: 7029; Pricing 1: 1=1.07, 10=0.95, 50=0.8866, 100=0.7847, 500=0.7415, 750=0.70228, 1000=0.61988 (CAD); Packaging: Cut Tape (CT); Type: MHz Crystal; Frequency: 16MHz; Load Capacitance: 20pF; Operating Temperature: -20°C ~ 70°C; Ratings: -; Mounting Type: Surface Mount; Package / Case: 4-SMD, No Lead (DFN, LCC); Size / Dimension: 0.126" L x 0.098" W (3.20mm x 2.50mm); Height: 0.031" (0.80mm); ComponentLink1URL: http://www.ctscorp.com/components/Datasheets/008-0288-0_F.pdf; ComponentLink1Description: http://www.ctscorp.com/components/Datasheets/008-0288-0_F.pdf; Supplier Part Number 1: CTX1293CT-ND